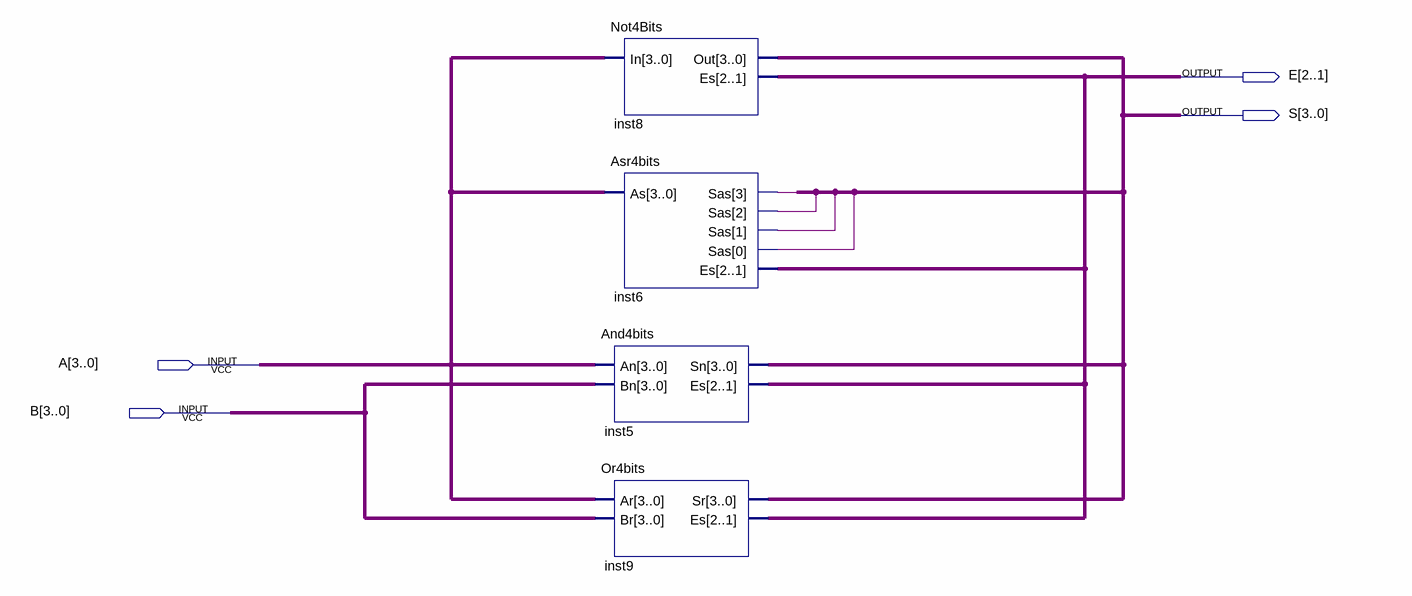
[diagram p0: schematic sheet]
// Quartus schematic BloqueLogica.bdf as structural Verilog: 4 symbols, 4 pins
module BloqueLogica (
  input  [3:0] A,
  input  [3:0] B,
  output [2:1] E,
  output [3:0] S
);

  wire inst6_sas, inst6_sas_2, inst6_sas_3, inst6_sas_4;

  Not4Bits inst8 (.In(A), .Out(S), .Es(E));
  Asr4bits inst6 (.As(A), .Sas({inst6_sas, inst6_sas_2, inst6_sas_3, inst6_sas_4}), .Es(E));
  And4bits inst5 (.An(A), .Bn(B), .Sn(S), .Es(E));
  Or4bits inst9 (.Ar(A), .Br(B), .Sr(S), .Es(E));
endmodule
